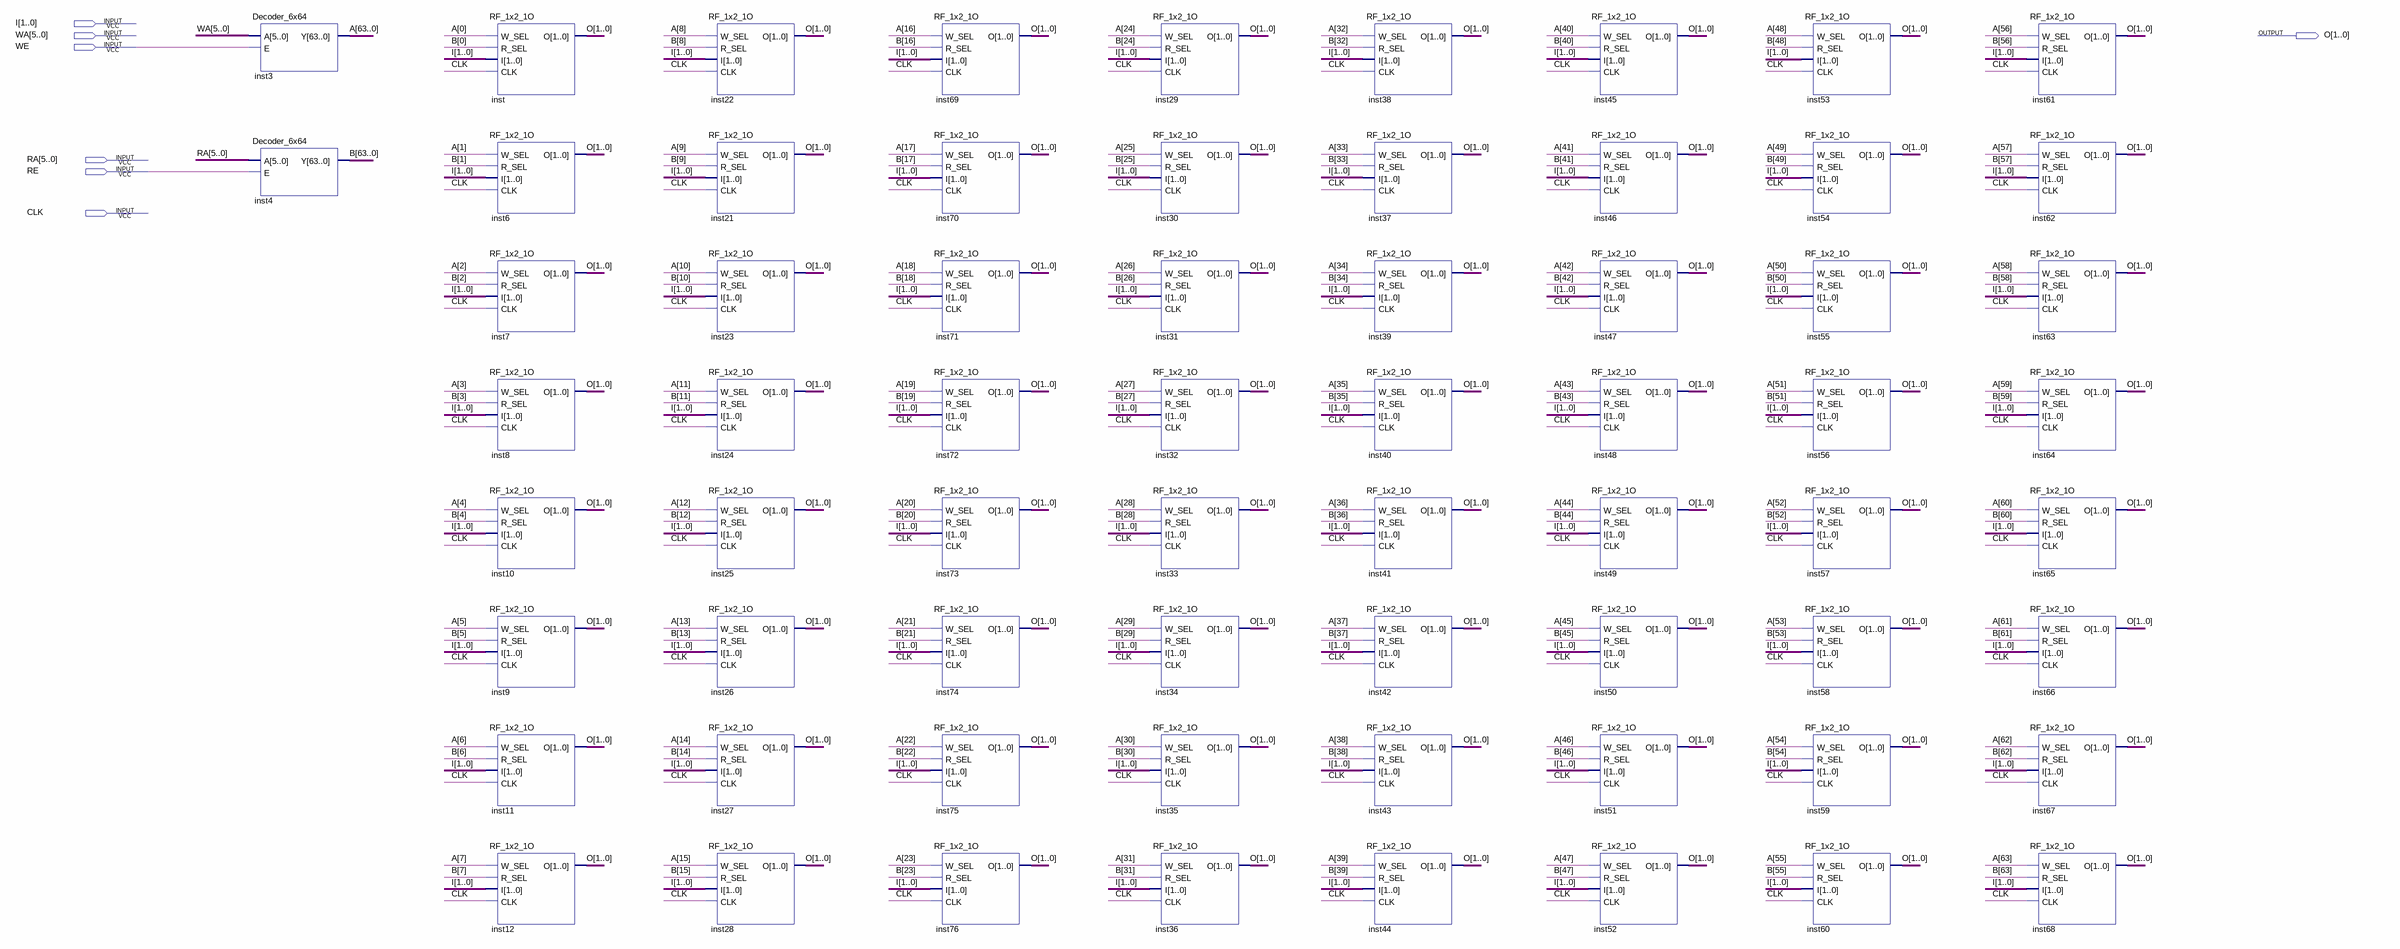
[diagram p0: schematic sheet]
// Quartus schematic RF_64x2_1O.bdf as structural Verilog: 66 symbols, 7 pins
module RF_64x2_1O (
  input  [1:0] I,
  input  [5:0] WA,
  input  WE,
  input  [5:0] RA,
  input  RE,
  input  CLK,
  output [1:0] O
);

  wire [63:0] A, B;

  Decoder_6x64 inst3 (.A(WA), .E(WE), .Y(A));
  Decoder_6x64 inst4 (.A(RA), .E(RE), .Y(B));
  RF_1x2_1O inst (.W_SEL(A[0]), .R_SEL(B[0]), .I(I), .CLK(CLK), .O(O));
  RF_1x2_1O inst6 (.W_SEL(A[1]), .R_SEL(B[1]), .I(I), .CLK(CLK), .O(O));
  RF_1x2_1O inst7 (.W_SEL(A[2]), .R_SEL(B[2]), .I(I), .CLK(CLK), .O(O));
  RF_1x2_1O inst8 (.W_SEL(A[3]), .R_SEL(B[3]), .I(I), .CLK(CLK), .O(O));
  RF_1x2_1O inst10 (.W_SEL(A[4]), .R_SEL(B[4]), .I(I), .CLK(CLK), .O(O));
  RF_1x2_1O inst9 (.W_SEL(A[5]), .R_SEL(B[5]), .I(I), .CLK(CLK), .O(O));
  RF_1x2_1O inst11 (.W_SEL(A[6]), .R_SEL(B[6]), .I(I), .CLK(CLK), .O(O));
  RF_1x2_1O inst12 (.W_SEL(A[7]), .R_SEL(B[7]), .I(I), .CLK(CLK), .O(O));
  RF_1x2_1O inst22 (.W_SEL(A[8]), .R_SEL(B[8]), .I(I), .CLK(CLK), .O(O));
  RF_1x2_1O inst21 (.W_SEL(A[9]), .R_SEL(B[9]), .I(I), .CLK(CLK), .O(O));
  RF_1x2_1O inst23 (.W_SEL(A[10]), .R_SEL(B[10]), .I(I), .CLK(CLK), .O(O));
  RF_1x2_1O inst24 (.W_SEL(A[11]), .R_SEL(B[11]), .I(I), .CLK(CLK), .O(O));
  RF_1x2_1O inst25 (.W_SEL(A[12]), .R_SEL(B[12]), .I(I), .CLK(CLK), .O(O));
  RF_1x2_1O inst26 (.W_SEL(A[13]), .R_SEL(B[13]), .I(I), .CLK(CLK), .O(O));
  RF_1x2_1O inst27 (.W_SEL(A[14]), .R_SEL(B[14]), .I(I), .CLK(CLK), .O(O));
  RF_1x2_1O inst28 (.W_SEL(A[15]), .R_SEL(B[15]), .I(I), .CLK(CLK), .O(O));
  RF_1x2_1O inst69 (.W_SEL(A[16]), .R_SEL(B[16]), .I(I), .CLK(CLK), .O(O));
  RF_1x2_1O inst70 (.W_SEL(A[17]), .R_SEL(B[17]), .I(I), .CLK(CLK), .O(O));
  RF_1x2_1O inst71 (.W_SEL(A[18]), .R_SEL(B[18]), .I(I), .CLK(CLK), .O(O));
  RF_1x2_1O inst72 (.W_SEL(A[19]), .R_SEL(B[19]), .I(I), .CLK(CLK), .O(O));
  RF_1x2_1O inst73 (.W_SEL(A[20]), .R_SEL(B[20]), .I(I), .CLK(CLK), .O(O));
  RF_1x2_1O inst74 (.W_SEL(A[21]), .R_SEL(B[21]), .I(I), .CLK(CLK), .O(O));
  RF_1x2_1O inst75 (.W_SEL(A[22]), .R_SEL(B[22]), .I(I), .CLK(CLK), .O(O));
  RF_1x2_1O inst76 (.W_SEL(A[23]), .R_SEL(B[23]), .I(I), .CLK(CLK), .O(O));
  RF_1x2_1O inst29 (.W_SEL(A[24]), .R_SEL(B[24]), .I(I), .CLK(CLK), .O(O));
  RF_1x2_1O inst30 (.W_SEL(A[25]), .R_SEL(B[25]), .I(I), .CLK(CLK), .O(O));
  RF_1x2_1O inst31 (.W_SEL(A[26]), .R_SEL(B[26]), .I(I), .CLK(CLK), .O(O));
  RF_1x2_1O inst32 (.W_SEL(A[27]), .R_SEL(B[27]), .I(I), .CLK(CLK), .O(O));
  RF_1x2_1O inst33 (.W_SEL(A[28]), .R_SEL(B[28]), .I(I), .CLK(CLK), .O(O));
  RF_1x2_1O inst34 (.W_SEL(A[29]), .R_SEL(B[29]), .I(I), .CLK(CLK), .O(O));
  RF_1x2_1O inst35 (.W_SEL(A[30]), .R_SEL(B[30]), .I(I), .CLK(CLK), .O(O));
  RF_1x2_1O inst36 (.W_SEL(A[31]), .R_SEL(B[31]), .I(I), .CLK(CLK), .O(O));
  RF_1x2_1O inst38 (.W_SEL(A[32]), .R_SEL(B[32]), .I(I), .CLK(CLK), .O(O));
  RF_1x2_1O inst37 (.W_SEL(A[33]), .R_SEL(B[33]), .I(I), .CLK(CLK), .O(O));
  RF_1x2_1O inst39 (.W_SEL(A[34]), .R_SEL(B[34]), .I(I), .CLK(CLK), .O(O));
  RF_1x2_1O inst40 (.W_SEL(A[35]), .R_SEL(B[35]), .I(I), .CLK(CLK), .O(O));
  RF_1x2_1O inst41 (.W_SEL(A[36]), .R_SEL(B[36]), .I(I), .CLK(CLK), .O(O));
  RF_1x2_1O inst42 (.W_SEL(A[37]), .R_SEL(B[37]), .I(I), .CLK(CLK), .O(O));
  RF_1x2_1O inst43 (.W_SEL(A[38]), .R_SEL(B[38]), .I(I), .CLK(CLK), .O(O));
  RF_1x2_1O inst44 (.W_SEL(A[39]), .R_SEL(B[39]), .I(I), .CLK(CLK), .O(O));
  RF_1x2_1O inst45 (.W_SEL(A[40]), .R_SEL(B[40]), .I(I), .CLK(CLK), .O(O));
  RF_1x2_1O inst46 (.W_SEL(A[41]), .R_SEL(B[41]), .I(I), .CLK(CLK), .O(O));
  RF_1x2_1O inst47 (.W_SEL(A[42]), .R_SEL(B[42]), .I(I), .CLK(CLK), .O(O));
  RF_1x2_1O inst48 (.W_SEL(A[43]), .R_SEL(B[43]), .I(I), .CLK(CLK), .O(O));
  RF_1x2_1O inst49 (.W_SEL(A[44]), .R_SEL(B[44]), .I(I), .CLK(CLK), .O(O));
  RF_1x2_1O inst50 (.W_SEL(A[45]), .R_SEL(B[45]), .I(I), .CLK(CLK), .O(O));
  RF_1x2_1O inst51 (.W_SEL(A[46]), .R_SEL(B[46]), .I(I), .CLK(CLK), .O(O));
  RF_1x2_1O inst52 (.W_SEL(A[47]), .R_SEL(B[47]), .I(I), .CLK(CLK), .O(O));
  RF_1x2_1O inst53 (.W_SEL(A[48]), .R_SEL(B[48]), .I(I), .CLK(CLK), .O(O));
  RF_1x2_1O inst54 (.W_SEL(A[49]), .R_SEL(B[49]), .I(I), .CLK(CLK), .O(O));
  RF_1x2_1O inst55 (.W_SEL(A[50]), .R_SEL(B[50]), .I(I), .CLK(CLK), .O(O));
  RF_1x2_1O inst56 (.W_SEL(A[51]), .R_SEL(B[51]), .I(I), .CLK(CLK), .O(O));
  RF_1x2_1O inst57 (.W_SEL(A[52]), .R_SEL(B[52]), .I(I), .CLK(CLK), .O(O));
  RF_1x2_1O inst58 (.W_SEL(A[53]), .R_SEL(B[53]), .I(I), .CLK(CLK), .O(O));
  RF_1x2_1O inst59 (.W_SEL(A[54]), .R_SEL(B[54]), .I(I), .CLK(CLK), .O(O));
  RF_1x2_1O inst60 (.W_SEL(A[55]), .R_SEL(B[55]), .I(I), .CLK(CLK), .O(O));
  RF_1x2_1O inst61 (.W_SEL(A[56]), .R_SEL(B[56]), .I(I), .CLK(CLK), .O(O));
  RF_1x2_1O inst62 (.W_SEL(A[57]), .R_SEL(B[57]), .I(I), .CLK(CLK), .O(O));
  RF_1x2_1O inst63 (.W_SEL(A[58]), .R_SEL(B[58]), .I(I), .CLK(CLK), .O(O));
  RF_1x2_1O inst64 (.W_SEL(A[59]), .R_SEL(B[59]), .I(I), .CLK(CLK), .O(O));
  RF_1x2_1O inst65 (.W_SEL(A[60]), .R_SEL(B[60]), .I(I), .CLK(CLK), .O(O));
  RF_1x2_1O inst66 (.W_SEL(A[61]), .R_SEL(B[61]), .I(I), .CLK(CLK), .O(O));
  RF_1x2_1O inst67 (.W_SEL(A[62]), .R_SEL(B[62]), .I(I), .CLK(CLK), .O(O));
  RF_1x2_1O inst68 (.W_SEL(A[63]), .R_SEL(B[63]), .I(I), .CLK(CLK), .O(O));
endmodule
